# EAGLE design wireless (EAGLE 6.2)
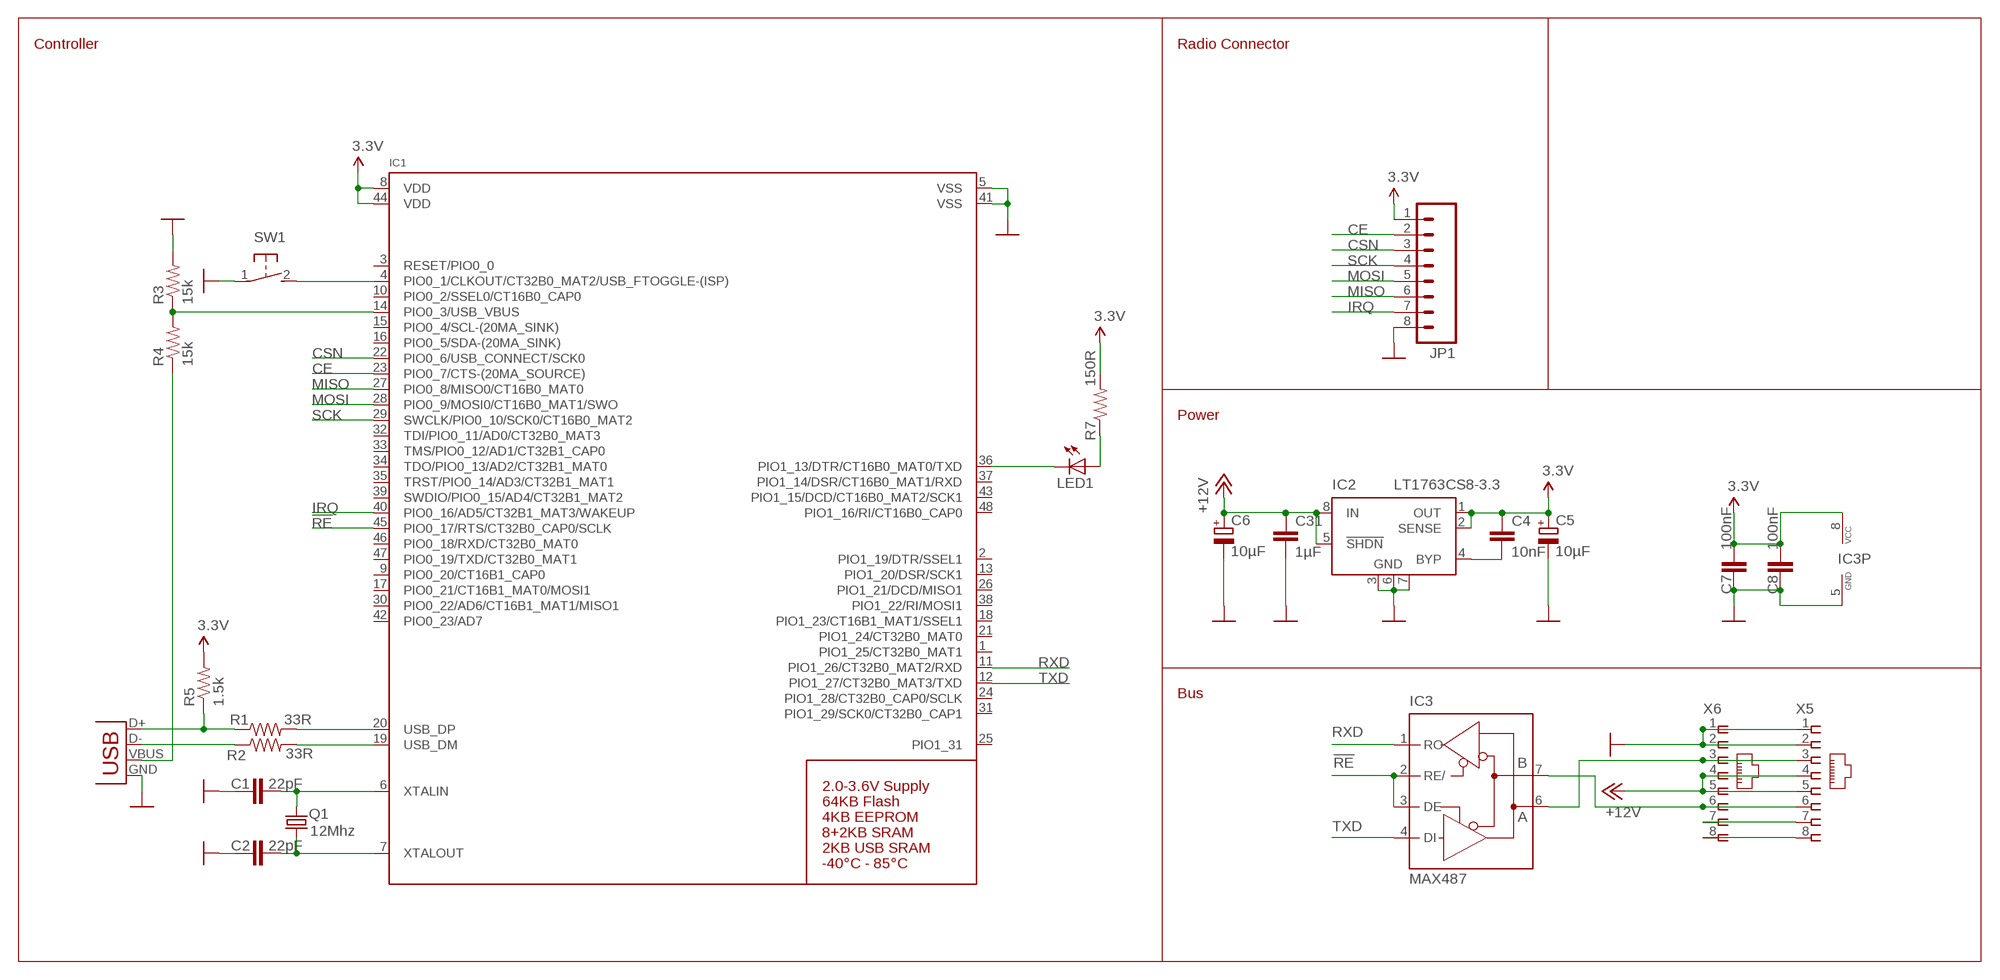
[diagram p0: schematic, sheet 1]

## Parts
C1  22pF  CAP0402-CAP  [0402-CAP]
C2  22pF  CAP0402-CAP  [0402-CAP]
C4  10nF  CAP0402-CAP  [0402-CAP]
C5  10µF  CPOL-EUSMCA  [SMC_A]
C6  10µF  CPOL-EUSMCD  [SMC_D]
C7  100nF  CAP0402-CAP  [0402-CAP]
C8  100nF  CAP0402-CAP  [0402-CAP]
C31  1µF  CAP0805  [0805]
IC1  LPC1347_QFP48  [LQFP48]
IC2  LT1763CS8-3.3  [SOIC8]
IC3  MAX487  MAX481CSA  [SO08]
JP1  M081X08  [1X08]
LED1  LEDCHIPLED_0805  [CHIPLED_0805]
Q1  12Mhz  X22-OSCILLATOR  [X22]
R1  33R  RESISTOR0402-RES  [0402-RES]
R2  33R  RESISTOR0402-RES  [0402-RES]
R3  15k  RESISTOR0402-RES  [0402-RES]
R4  15k  RESISTOR0402-RES  [0402-RES]
R5  1.5k  RESISTOR0402-RES  [0402-RES]
R7  150R  RESISTOR0402-RES  [0402-RES]
SW1  SWITCH_MCTAEF  [SWITCH_MCTAEF]
X1  USBSMD  [USB-MINIB]
X5  RJ45-8L-B  [RJ45-NO-SHIELD]
X6  RJ45-8L-B  [RJ45-NO-SHIELD]

## Nets
3.3V: C4.1 C5.+ C7.2 C8.2 IC1.8(VDD) IC1.44(VDD) IC2.1(OUT) IC2.2(SENSE) IC3.8(VCC) JP1.1 R5.2 R7.2
!RE: IC1.45(PIO0_17/RTS/CT32B0_CAP0/SCLK) IC3.2(RE/) IC3.3(DE)
+12V: C6.+ C31.1 IC2.5(!SHDN) IC2.8(IN) X5.4 X5.5 X6.4 X6.5
A1: IC3.6(A) X5.3 X6.3
B1: IC3.7(B) X5.6 X6.6
CE: IC1.23(PIO0_7/CTS-(20MA_SOURCE)) JP1.2
CSN: IC1.22(PIO0_6/USB_CONNECT/SCK0) JP1.3
GND: C1.1 C2.1 C5.- C6.- C7.1 C8.1 C31.2 IC1.5(VSS) IC1.41(VSS) IC2.3(GND) IC2.6(GND) IC2.7(GND) IC3.5(GND) JP1.8 R3.2 SW1.1 X1.GND X5.1 X5.2 X6.1 X6.2
IRQ: IC1.40(PIO0_16/AD5/CT32B1_MAT3/WAKEUP) JP1.7
MISO: IC1.27(PIO0_8/MISO0/CT16B0_MAT0) JP1.6
MOSI: IC1.28(PIO0_9/MOSI0/CT16B0_MAT1/SWO) JP1.5
N$1: C2.2 IC1.7(XTALOUT) Q1.1
N$2: C1.2 IC1.6(XTALIN) Q1.3
N$3: IC1.20(USB_DP) R1.2
N$4: IC1.19(USB_DM) R2.2
N$5: R1.1 R5.1 X1.D+
N$6: R2.1 X1.D-
N$7: R4.1 X1.VBUS
N$8: IC1.14(PIO0_3/USB_VBUS) R3.1 R4.2
N$9: IC1.4(PIO0_1/CLKOUT/CT32B0_MAT2/USB_FTOGGLE-(ISP)) SW1.2
N$11: IC1.36(PIO1_13/DTR/CT16B0_MAT0/TXD) LED1.C
N$12: C4.2 IC2.4(BYP)
N$13: LED1.A R7.1
RXD: IC1.11(PIO1_26/CT32B0_MAT2/RXD) IC3.1(RO)
SCK: IC1.29(SWCLK/PIO0_10/SCK0/CT16B0_MAT2) JP1.4
SPARE1: X5.7 X6.7
SPARE2: X5.8 X6.8
TXD: IC1.12(PIO1_27/CT32B0_MAT3/TXD) IC3.4(DI)
Unconnected: IC1.1(PIO1_25/CT32B0_MAT1) IC1.2(PIO1_19/DTR/SSEL1) IC1.3(RESET/PIO0_0) IC1.9(PIO0_20/CT16B1_CAP0) IC1.10(PIO0_2/SSEL0/CT16B0_CAP0) IC1.13(PIO1_20/DSR/SCK1) IC1.15(PIO0_4/SCL-(20MA_SINK)) IC1.16(PIO0_5/SDA-(20MA_SINK)) IC1.17(PIO0_21/CT16B1_MAT0/MOSI1) IC1.18(PIO1_23/CT16B1_MAT1/SSEL1) IC1.21(PIO1_24/CT32B0_MAT0) IC1.24(PIO1_28/CT32B0_CAP0/SCLK) IC1.25(PIO1_31) IC1.26(PIO1_21/DCD/MISO1) IC1.30(PIO0_22/AD6/CT16B1_MAT1/MISO1) IC1.31(PIO1_29/SCK0/CT32B0_CAP1) IC1.32(TDI/PIO0_11/AD0/CT32B0_MAT3) IC1.33(TMS/PIO0_12/AD1/CT32B1_CAP0) IC1.34(TDO/PIO0_13/AD2/CT32B1_MAT0) IC1.35(TRST/PIO0_14/AD3/CT32B1_MAT1) IC1.37(PIO1_14/DSR/CT16B0_MAT1/RXD) IC1.38(PIO1_22/RI/MOSI1) IC1.39(SWDIO/PIO0_15/AD4/CT32B1_MAT2) IC1.42(PIO0_23/AD7) IC1.43(PIO1_15/DCD/CT16B0_MAT2/SCK1) IC1.46(PIO0_18/RXD/CT32B0_MAT0) IC1.47(PIO0_19/TXD/CT32B0_MAT1) IC1.48(PIO1_16/RI/CT16B0_CAP0)

## Notes on the sheet
- Controller | Radio Connector
- Power
- Bus

## Library data of the parts
C1 C2 C4 C7 C8 C31 = SparkFun-Capacitors:CAP: Capacitor Standard 0603 ceramic capacitor, and 0.1" leaded capacitor.
C5 C6 = rcl:CPOL-EU: POLARIZED CAPACITOR, European symbol
IC1 = microbuilder:LPC1347_QFP48: LPC1347 - ARM Cortex M3 72MHz MCU Supply: 2.0-3.6V 12-bit 500kHz ADC Flash: 64KB EEPROM: 4KB SRAM: 8KB SRAM0 + 2KB SRAM1 + 2KB USB Temp: -40°C - 85°C
IC2 = linear-technology:LT1763CS8: 500mA, Low Noise, LDO Micropower Regulators Source: http://cds.linear.com/docs/Datasheet/1763ff.pdf; MPN: LT1763CS8-3.3; OC_FARNELL: 1273617; OC_NEWARK: 57M6055
IC3 = maxim:MAX481CSA: RS485 TRANSEIVER; MF: MAXIM; MPN: MAX481CSA; OC_FARNELL: unknown; OC_NEWARK: 90C3817
JP1 = SparkFun-Connectors:M08: Header 8 Standard 8-pin 0.1" header. Use with straight break away headers (SKU : PRT-00116), right angle break away headers (PRT-00553), swiss pins (PRT-00743), machine pins (PRT-00117), and female headers (PRT-00115).
LED1 = led:LED: LED OSRAM: - CHIPLED LG R971, LG N971, LY N971, LG Q971, LY Q971, LO R971, LY R971 LH N974, LH R974 LS Q976, LO Q976, LY Q976 LO Q996 - Hyper CHIPLED LW Q18S LB Q993, LB Q99A, LB R99A - SideLED LS A670, LO A670, LY A670, LG A670, LP A670 LB A673, LV A673, LT A673, LW A673 LH A674 LY A675 LS A676, LA A676, LO A676, LY A676, LW A676 LS A679, LY A679, LG A679 - Hyper Micro SIDELED® LS Y876, LA Y876, LO Y876, LY Y876 LT Y87S - SmartLED LW L88C, LW L88S LB L89C, LB L89S, LG L890 LS L89K, LO L89K, LY L89K LS L896, LA L896, LO L896, LY L896 - TOPLED LS T670, LO T670, LY T670, LG T670, LP T670 LSG T670, LSP T670, LSY T670, LOP T670, LYG T670 LG T671, LOG T671, LSG T671 LB T673, LV T673, LT T673, LW T673 LH T674 LS T676, LA T676, LO T676, LY T676, LB T676, LH T676, LSB T676, LW T676 LB T67C, LV T67C, LT T67C, LS T67K, LO T67K, LY T67K, LW E67C LS E67B, LA E67B, LO E67B, LY E67B, LB E67C, LV E67C, LT E67C LW T67C LS T679, LY T679, LG T679 LS T770, LO T770, LY T770, LG T770, LP T770 LB T773, LV T773, LT T773, LW T773 LH T774 LS E675, LA E675, LY E675, LS T675 LS T776, LA T776, LO T776, LY T776, LB T776 LHGB T686 LT T68C, LB T68C - Hyper Mini TOPLED® LB M676 - Mini TOPLED Santana® LG M470 LS M47K, LO M47K, LY M47K Source: http://www.osram.convergy.de LUXEON: - LUMILED® LXK2-PW12-R00, LXK2-PW12-S00, LXK2-PW14-U00, LXK2-PW14-V00 LXK2-PM12-R00, LXK2-PM12-S00, LXK2-PM14-U00 LXK2-PE12-Q00, LXK2-PE12-R00, LXK2-PE12-S00, LXK2-PE14-T00, LXK2-PE14-U00 LXK2-PB12-K00, LXK2-PB12-L00, LXK2-PB12-M00, LXK2-PB14-N00, LXK2-PB14-P00, LXK2-PB14-Q00 LXK2-PR12-L00, LXK2-PR12-M00, LXK2-PR14-Q00, LXK2-PR14-R00 LXK2-PD12-Q00, LXK2-PD12-R00, LXK2-PD12-S00 LXK2-PH12-R00, LXK2-PH12-S00 LXK2-PL12-P00, LXK2-PL12-Q00, LXK2-PL12-R00 Source: www.luxeon.com KINGBRIGHT: KA-3528ASYC Source: www.kingbright.com
Q1 = seb:X22-OSCILLATOR
R1-R5 R7 = SparkFun-Passives:RESISTOR: Resistor Basic schematic elements and footprints for 0603, 1206, and PTH resistors.
SW1 = seb:SWITCH_MCTAEF
X1 = SparkFun-Connectors:USB: USB Connectors USB-B-PTH is fully proven SKU : PRT-00139 USB-miniB is fully proven SKU : PRT-00587 USB-A-PCB is untested. USB-A-H is throughly reviewed, but untested. Spark Fun Electronics SKU : PRT-00437 USB-B-SMT is throughly reviewed, but untested. Needs silkscreen touching up. USB-A-S has not been used/tested USB-MB-H has not been used/tested
X5 X6 = con-tycoelectronics:RJ45: CORCOM Modular RJ Jacks No Shield Source: www.tycoelectronics.com .. ENG_DS_1654001_1099_RJ_L_0507.pdf; MF: TYCO ELECTRONICS; MPN: RJ45-8L-B; OC_FARNELL: 1279843; OC_NEWARK: 52K4445

## Board
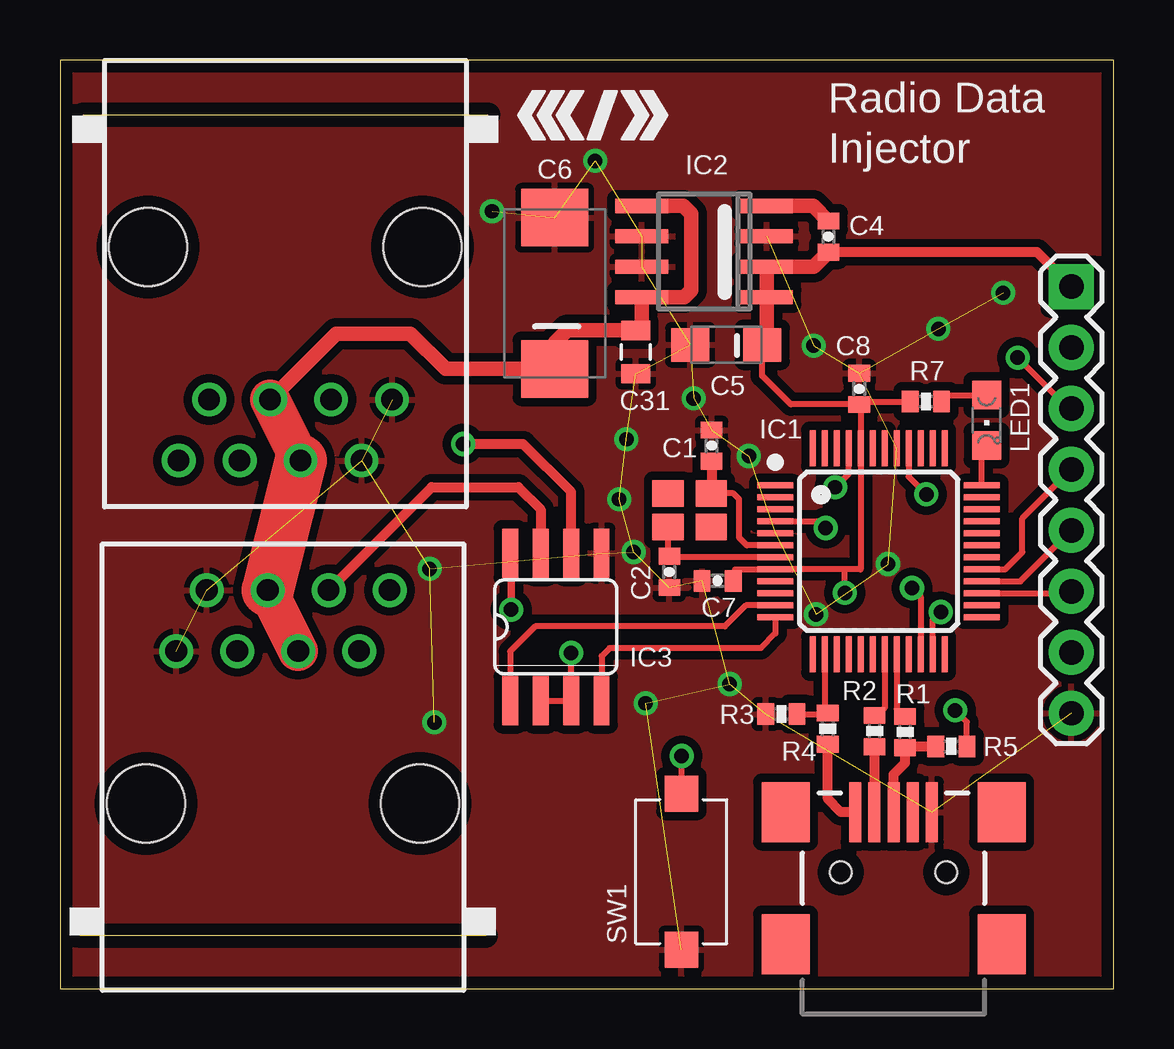
[diagram p1: board, top side]
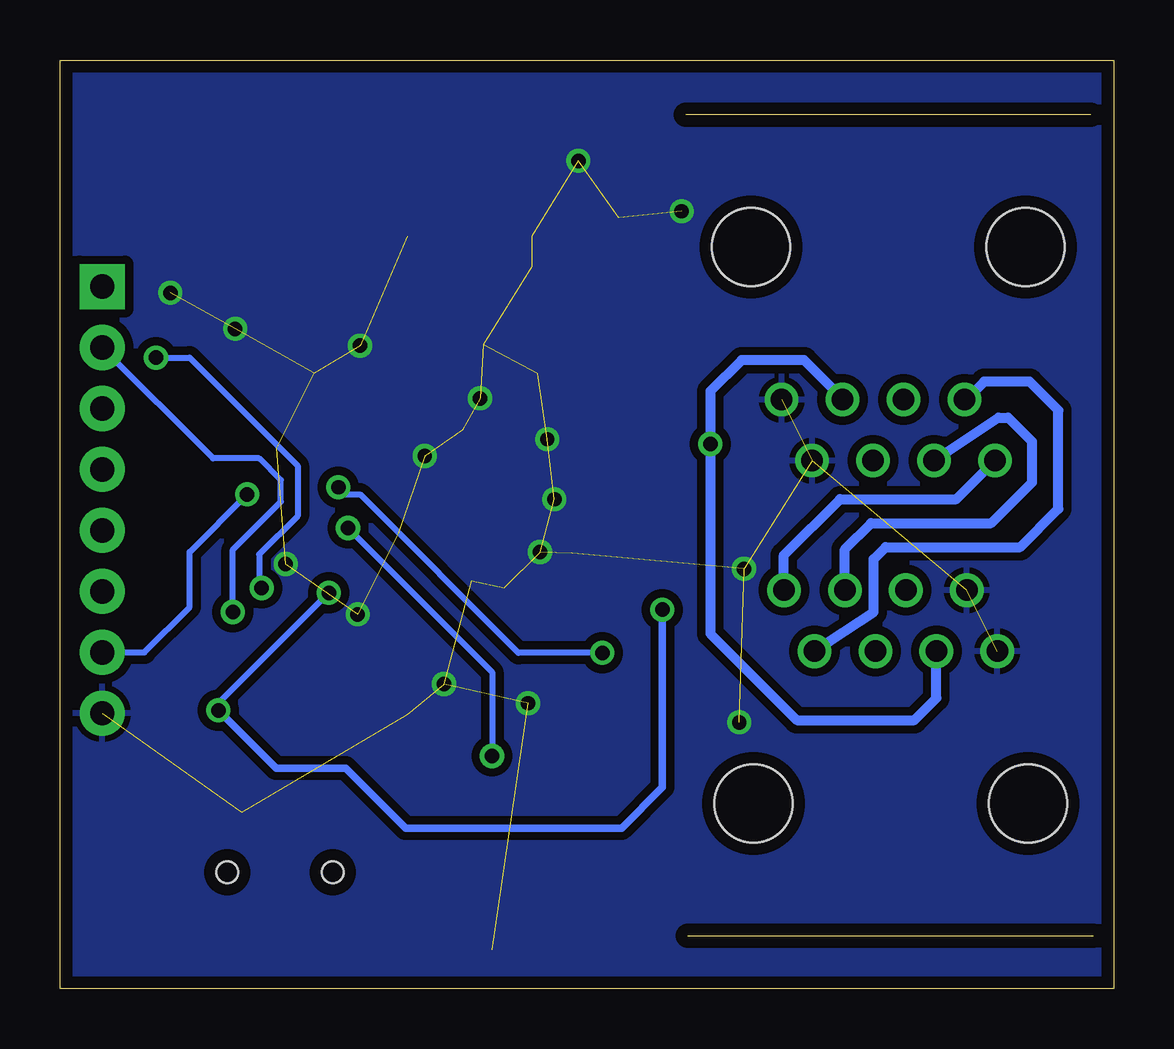
[diagram p2: board, bottom side, seen from below]

Size 43.9 x 38.7 mm. Coordinates in mm from the lower left corner, seen from the top.
Outline: 0,0 43.9,0 43.9,38.7 0,38.7 0,0
Copper layers (1*16): Top 0.035mm / dielectric 1.5mm / Bottom 0.035mm
Design rules "default *": minimum track width 0.25mm, minimum drill 0.4mm, track to track 8mil, track to pad 8mil, pad to pad 8mil, via to via 8mil, smd to smd 8mil, copper to edge 20mil, drill to drill 8mil, minimum pad ring 10mil, minimum via ring 8mil, stop-mask expansion 4mil, vias tented up to drill 40mil, thermal gap 10mil

### Footprints (pad centres in the part's own frame; a part is rotated, then mirrored left to right if it is on the bottom)
0402-CAP = smd 0.7 x 0.9: 1 -0.65,0; 2 0.65,0
SMC_A = smd 1.6 x 1.4: + -1.5,0; - 1.5,0
SMC_D = smd 2.4 x 2.8: + -3.15,0; - 3.15,0
0805 = smd 0.8 x 1.2: 1 -0.9,0; 2 0.9,0
LQFP48 = smd 1.5 x 0.25: 1 -4.3,2.75; 2 -4.3,2.25; 3 -4.3,1.75; 4 -4.3,1.25; 5 -4.3,0.75; 6 -4.3,0.25; 7 -4.3,-0.25; 8 -4.3,-0.75; 9 -4.3,-1.25; 10 -4.3,-1.75; 11 -4.3,-2.25; 12 -4.3,-2.75; 25 4.3,-2.75; 26 4.3,-2.25; 27 4.3,-1.75; 28 4.3,-1.25; 29 4.3,-0.75; 30 4.3,-0.25; 31 4.3,0.25; 32 4.3,0.75; 33 4.3,1.25; 34 4.3,1.75; 35 4.3,2.25; 36 4.3,2.75 | smd 0.25 x 1.5: 13 -2.75,-4.3; 14 -2.25,-4.3; 15 -1.75,-4.3; 16 -1.25,-4.3; 17 -0.75,-4.3; 18 -0.25,-4.3; 19 0.25,-4.3; 20 0.75,-4.3; 21 1.25,-4.3; 22 1.75,-4.3; 23 2.25,-4.3; 24 2.75,-4.3; 37 2.75,4.3; 38 2.25,4.3; 39 1.75,4.3; 40 1.25,4.3; 41 0.75,4.3; 42 0.25,4.3; 43 -0.25,4.3; 44 -0.75,4.3; 45 -1.25,4.3; 46 -1.75,4.3; 47 -2.25,4.3; 48 -2.75,4.3
SOIC8 = smd 0.6 x 2.2: 1 -1.905,-2.6; 2 -0.635,-2.6; 3 0.635,-2.6; 4 1.905,-2.6; 5 1.905,2.6; 6 0.635,2.6; 7 -0.635,2.6; 8 -1.905,2.6
SO08 = smd 0.66 x 2.032: 1 -1.905,-3.073; 2 -0.635,-3.073; 3 0.635,-3.073; 4 1.905,-3.073; 5 1.905,3.073; 6 0.635,3.073; 7 -0.635,3.073; 8 -1.905,3.073
1X08 = drill 1.016 pad 1.88 square: 1 0,0 | drill 1.016 pad 1.88: 2 2.54,0; 3 5.08,0; 4 7.62,0; 5 10.16,0; 6 12.7,0; 7 15.24,0; 8 17.78,0
CHIPLED_0805 = smd 1.2 x 1.2: A 0,-1.05; C 0,1.05
X22 = smd 1.3 x 1.1: 1 0.9,0.7; 2 -0.9,0.7; 3 -0.9,-0.7; 4 0.9,-0.7
0402-RES = smd 0.7 x 0.9: 1 -0.65,0; 2 0.65,0
SWITCH_MCTAEF = smd 1.5 x 1.4: 1 -3.25,0; 2 3.25,0
USB-MINIB = smd 2.5 x 0.5: D+ 2.5,0; D- 2.5,0.8; GND 2.5,-1.6; ID 2.5,-0.8; VBUS 2.5,1.6 | smd 2.5 x 2: MTN1 -3,4.5; MTN2 2.5,4.5; MTN3 -3,-4.5; MTN4 2.5,-4.5 | hole 0.9: 0,2.2; 0,-2.2
RJ45-NO-SHIELD = drill 0.9 pad 1.4: 1 -4.445,6.35; 2 -3.175,8.89; 3 -1.905,6.35; 4 -0.635,8.89; 5 0.635,6.35; 6 1.905,8.89; 7 3.175,6.35; 8 4.445,8.89 | hole 3.251: -5.715,0; 5.715,0

### Placement (x,y rotation side)
C1  27.15,22.63 270 top
C2  25.39,17.37 90 top
C4  32.02,31.34 90 top
C5  27.76,26.83 180 top
C6  20.61,28.98 90 top
C7  27.4,17 0 top
C8  33.3,25 270 top
C31  23.99,26.53 270 top
IC1  34.11,18.23 0 top
IC2  26.84,30.72 90 top
IC3  20.66,15.08 0 top
JP1  42.14,29.26 270 top
LED1  38.61,23.69 180 top
Q1  26.23,19.94 180 top
R1  35.21,10.7 90 top
R2  33.94,10.74 90 top
R3  30.06,11.45 180 top
R4  31.99,10.84 90 top
R5  37.14,10.1 0 top
R7  36.08,24.47 180 top
SW1  25.89,4.88 90 top
U$2  [C3D2_LOGO_SMALL]  19.1,36.4 0 top
X1  34.73,4.86 90 top
X5  9.39,30.9 180 top
X6  9.29,7.72 0 top

### Tracks (layer width: path | path; a pad name or v marks a point on that pad's centre or on a via)
3.3V  (via drill 0.6 pad 0.4)
  Top 0.25: C7.2 28.13,17.48 IC1.8 32.7,17.48 | 33.36,24.29 C8.2 30.45,24.35 29.26,25.54 C5.+ | 33.36,24.29 IC1.44 33.36,17.48 32.7,17.48 | 33.36,24.29 33.54,24.47 R7.2 | R5.2 37.79,11.11 v37.3,11.6 | v32.7,16.5 32.7,17.48
  Top 0.305: IC3.8 18.8,18.11 v18.8,15.8
  Top 0.406: JP1.1 40.71,30.69 C4.1
  Top 0.61: C5.+ 29.44,27.01 IC2.1 IC2.2 31.41,30.09 C4.1
  Bottom 0.25: v37.3,11.6 37.3,11.9 v32.7,16.5
  Bottom 0.305: v18.8,15.8 18.8,8.4 20.5,6.7 29.5,6.7 32,9.2 34.9,9.2 v37.3,11.6
!RE  (via drill 0.6 pad 0.4)
  Top 0.25: IC3.2 IC3.3 v21.29,13.99 v21.3,14 | v32.3,20.9 32.86,21.46 IC1.45
  Bottom 0.25: v21.3,14 24.8,14 31.4,20.6 32,20.6 v32.3,20.9
+12V
  Top 0.61: IC2.5 25.97,32.62 26.3,32.3 26.3,29.1 26.01,28.82 IC2.8 24.24,27.68 C31.1 21.13,27.43 20.61,26.91 C6.+ 16.07,25.83 14.6,27.3 11.51,27.3 X5.5
  Top 1.676: X6.5 X6.4 | X5.4 X5.5
  Top 2.184: X6.4 X5.4
A1  (via drill 0.6 pad 0.4)
  Top 0.406: IC3.6 21.29,20.71 19.3,22.7 v16.8,22.7
  Bottom 0.406: X5.3 11.29,24.6 12.9,26.2 15.5,26.2 16.8,24.9 v16.8,22.7 16.8,14.8 13.2,11.2 8.3,11.2 7.39,12.12 X6.3
B1
  Top 0.406: X6.6 15.49,20.9 19.1,20.9 20.02,19.98 IC3.7
  Bottom 0.406: X6.6 11.2,18.3 10.1,19.4 5.1,19.4 3.4,21.1 3.4,22.8 4.4,23.8 4.8,23.8 X5.6
CE  (via drill 0.6 pad 0.4)
  Top 0.25: IC1.23 36.36,15.36 v36.7,15.7
  Bottom 0.25: v36.7,15.7 36.7,18.3 34.7,20.3 34.7,21.2 35.6,22.1 37.52,22.1 JP1.2
CSN  (via drill 0.6 pad 0.4)
  Top 0.25: JP1.3 42.02,24.18 v39.9,26.3 | v35.5,16.7 35.86,16.34 IC1.22
  Bottom 0.25: v39.9,26.3 38.5,26.3 34,21.8 34,19.7 35.6,18.1 35.6,16.8 v35.5,16.7
GND  (via drill 0.6 pad 0.4)  (36 unrouted)
  other vias: 28.7,22.2 26.4,24.6 23.6,22.9 23.3,20.4 23.9,18.2 24.4,11.9 27.9,12.7 39.3,29 36.6,27.5 31.4,26.8 15.6,11.1 15.4,17.5 18,32.4 22.3,34.5 31.5,15.6 34.5,17.7
  pour Top (isolate 0.35): 43.9,38.7 0,38.7 0,0 43.9,0
  pour Bottom (isolate 0.35): 43.9,38.7 0,38.7 0,0 43.9,0
IRQ  (via drill 0.6 pad 0.4)
  Top 0.25: IC1.40 35.36,21.34 v36.1,20.6
  Bottom 0.25: JP1.7 40.38,14.02 38.5,15.9 38.5,18.2 v36.1,20.6
MISO
  Top 0.25: IC1.27 42.06,16.48 JP1.6
MOSI
  Top 0.25: IC1.28 40.02,16.98 JP1.5
N$1
  Top 0.25: IC1.7 25.43,17.98 C2.2 25.33,18.08 Q1.1
N$2
  Top 0.25: IC1.6 28.62,18.48 28.3,18.8 28.3,20.4 28.06,20.64 Q1.3
  Top 0.406: C1.2 27.15,20.66 Q1.3
N$3
  Top 0.25: IC1.20 34.86,11.65 R1.2
N$4
  Top 0.25: IC1.19 34.36,11.69 R2.2
N$5
  Top 0.406: X1.D+ 34.73,8.93 35.21,9.41 R1.1 35.26,10.1 R5.1
N$6
  Top 0.406: X1.D- R2.1
N$7
  Top 0.406: X1.VBUS 32.54,7.36 31.99,7.91 R4.1
N$8
  Top 0.25: IC1.14 31.86,11.62 R4.2 31.95,11.45 R3.1
N$9  (via drill 0.6 pad 0.4)
  Top 0.25: IC1.4 31.62,19.48 v31.9,19.2 | v25.9,9.7 v25.89,9.69 SW1.2
  Bottom 0.25: v31.9,19.2 25.9,13.2 v25.9,9.7
N$11
  Top 0.25: IC1.36 38.41,22.44 LED1.C
N$12
  Top 0.61: IC2.4 31.38,32.62 C4.2
N$13
  Top 0.25: R7.1 37,24.74 LED1.A
RXD
  Top 0.25: IC1.11 28.58,15.98 27.7,15.1 19.8,15.1 18.75,14.05 IC3.1
SCK
  Top 0.25: IC1.29 39.38,17.48 40.1,18.2 40.1,19.6 JP1.4
SPARE1
  Bottom 0.406: X6.7 10,15.7 10,17.9 9.5,18.4 3.9,18.4 2.3,20 2.3,24.1 3.5,25.3 5.4,25.3 6.15,24.55 X5.7
SPARE2
  Bottom 0.406: X6.8 13.74,18.07 11.4,20.4 6.56,20.4 X5.8
TXD
  Top 0.25: IC1.12 29.81,14.81 29.2,14.2 22.9,14.2 22.56,13.87 IC3.4

### Text on the board
tPlace: Radio Data | Injector
tValues: LPC1347 | 12Mhz